# Altium project HHL_Control_board_Rev1.PrjPcb (part 2 of 2)

## Sheet Ethernet.SchDoc
size 420 x 297 mm; Address1: Address1; Address2: Address2; Address3: Address3; Address4: Address4; DocumentNumber: *Э3; SheetNumber: 13; SheetTotal: 14; DocumentType: Схема электрическая *
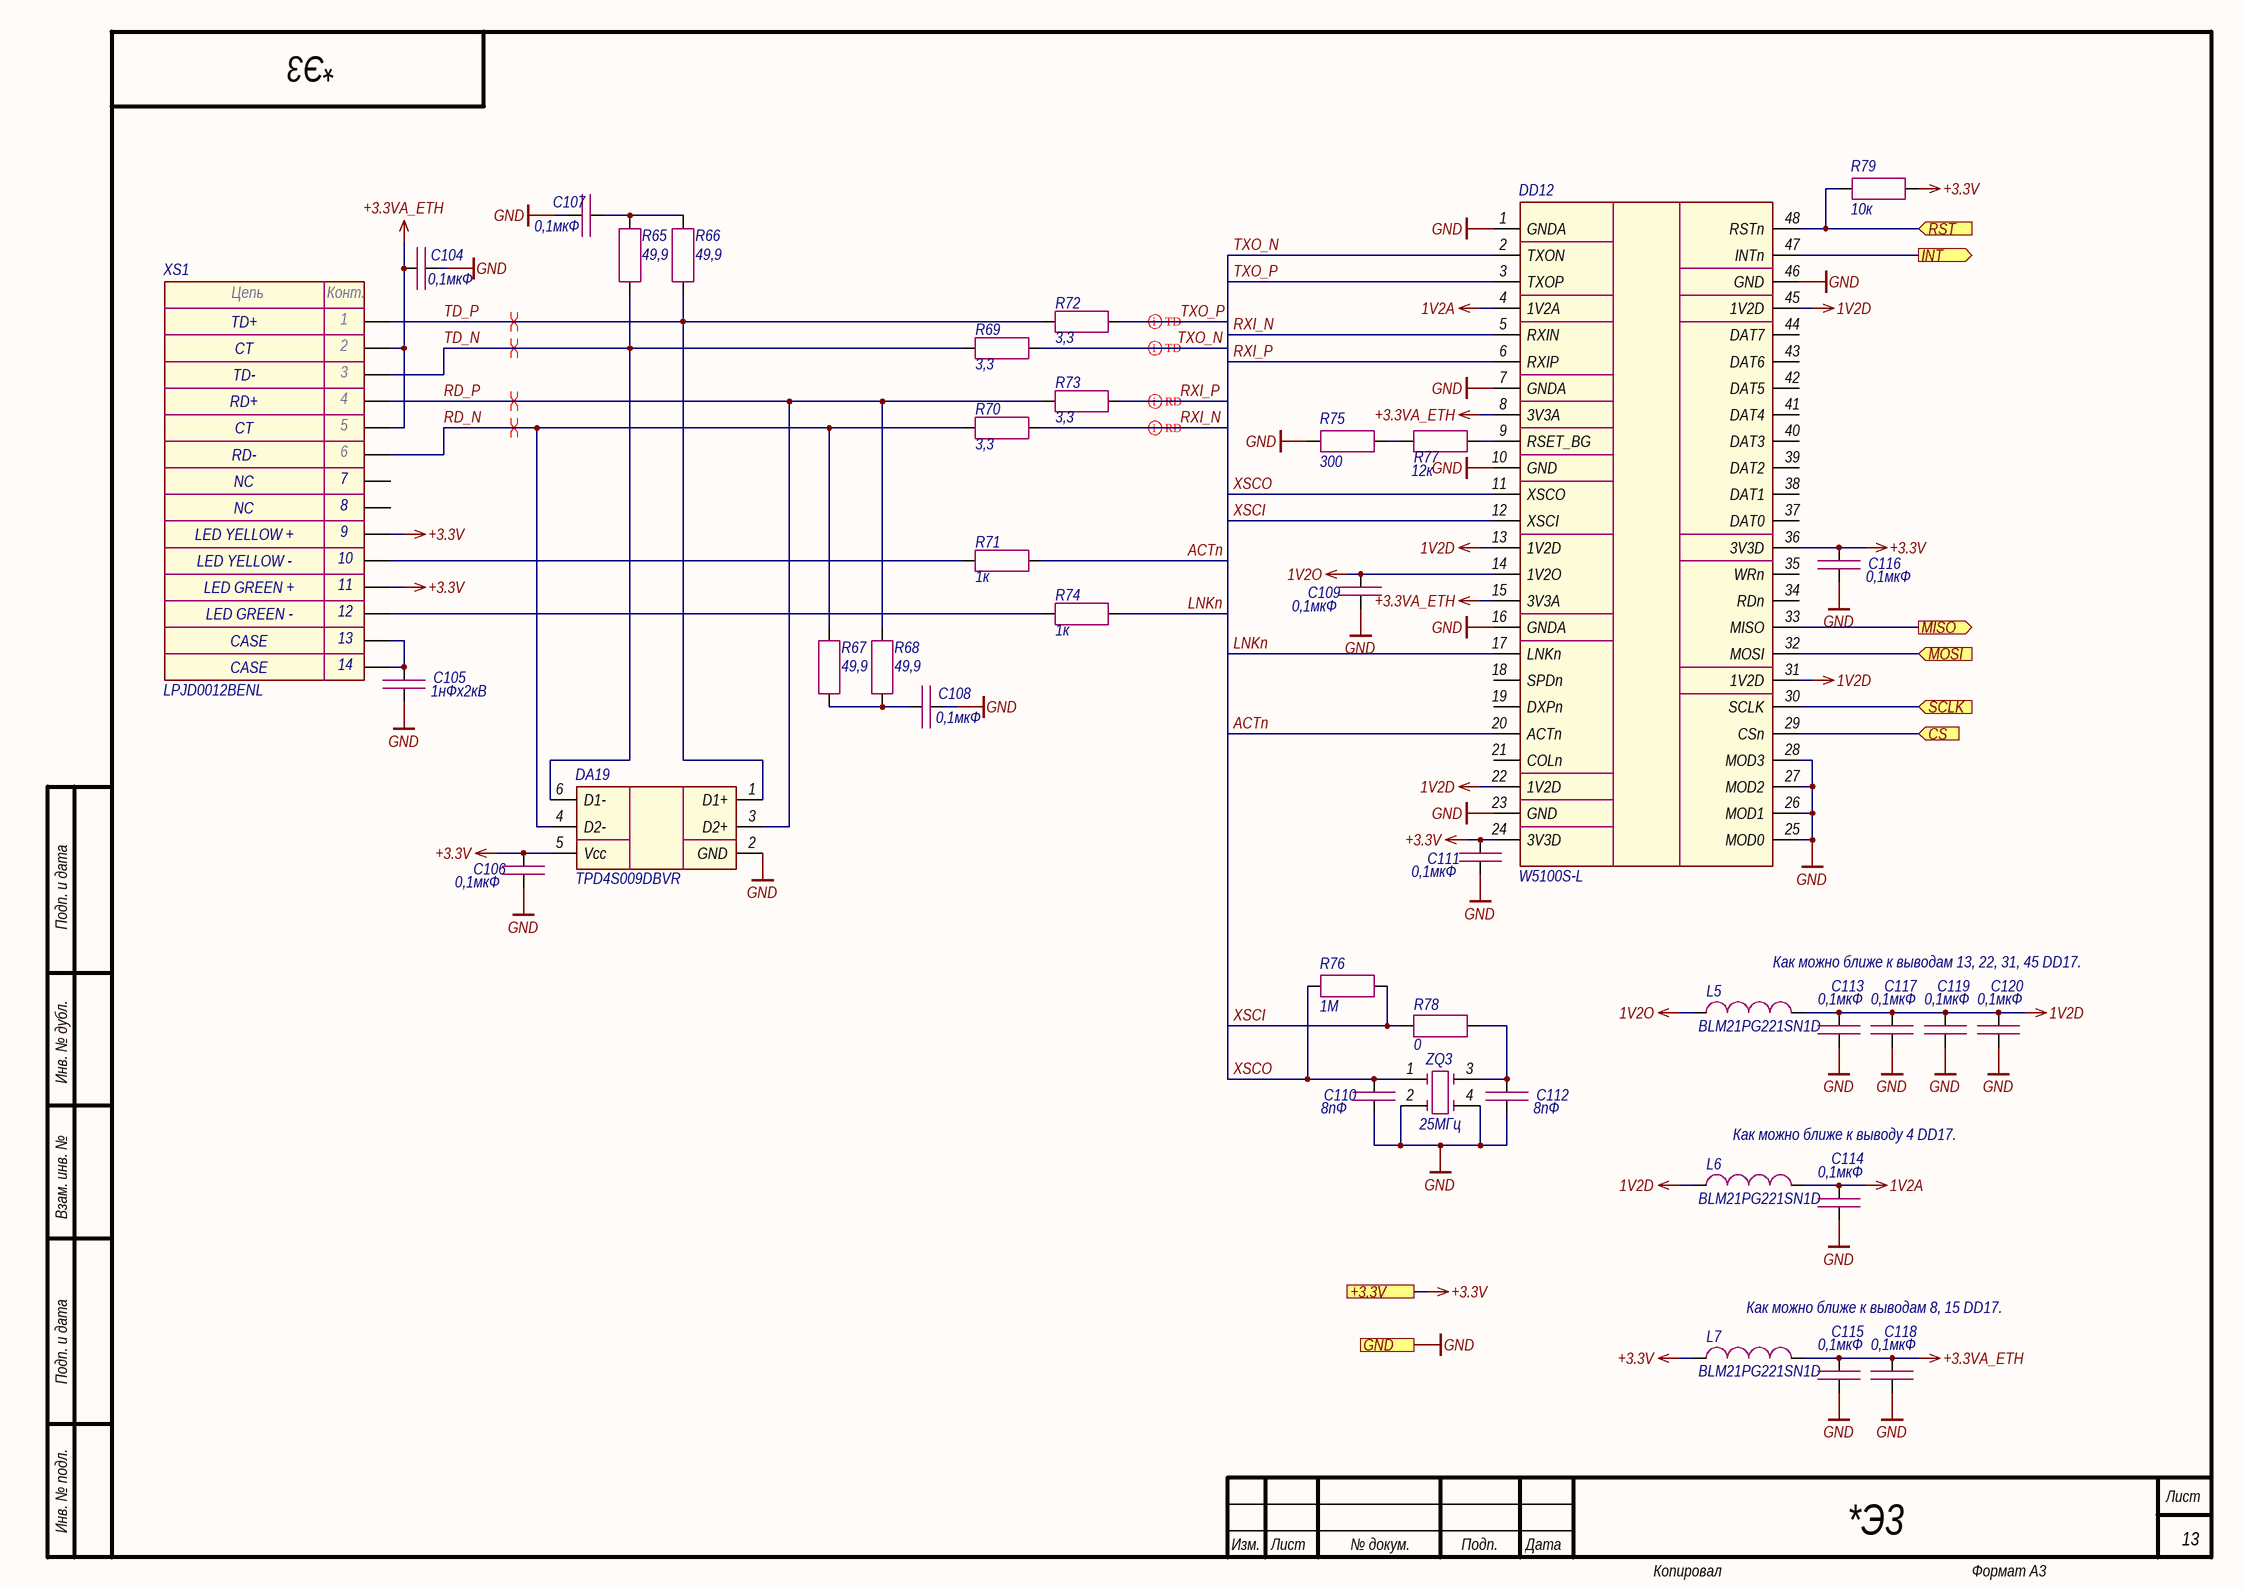
[diagram p12: Ethernet.SchDoc]

### Parts
C104  0,1мкФ  [CAP_0603]
C105  1нФх2кВ  [CAP_1206]
C106  0,1мкФ  [CAP_0603]
C107  0,1мкФ  [CAP_0603]
C108  0,1мкФ  [CAP_0603]
C109  0,1мкФ  [CAP_0603]
C110  8пФ  [CAP_0603]
C111  0,1мкФ  [CAP_0603]
C112  8пФ  [CAP_0603]
C113  0,1мкФ  [CAP_0603]
C114  0,1мкФ  [CAP_0603]
C115  0,1мкФ  [CAP_0603]
C116  0,1мкФ  [CAP_0603]
C117  0,1мкФ  [CAP_0603]
C118  0,1мкФ  [CAP_0603]
C119  0,1мкФ  [CAP_0603]
C120  0,1мкФ  [CAP_0603]
DA19  TPD4S009DBVR  [SOT-23-6]
DD12  W5100S-L  [LQFP-48]
L5  BLM21PG221SN1D  [IND_0805]
L6  BLM21PG221SN1D  [IND_0805]
L7  BLM21PG221SN1D  [IND_0805]
R65  49,9  [RES_0603]
R66  49,9  [RES_0603]
R67  49,9  [RES_0603]
R68  49,9  [RES_0603]
R69  3,3  [RES_0603]
R70  3,3  [RES_0603]
R71  1к  [RES_0603]
R72  3,3  [RES_0603]
R73  3,3  [RES_0603]
R74  1к  [RES_0603]
R75  300  [RES_0603]
R76  1М  [RES_0603]
R77  12к  [RES_0603]
R78  0  [RES_0603]
R79  10к  [RES_0603]
XS1  LPJD0012BENL  [LPJD0012BENL]
ZQ3  25МГц  [7M]

### Ports
+3.3V (see Main[1C], Button[1D], Fiber_interlock[2C], Flow_sensor[2C], LD_driver[1D], Power_supply[2C], RS-485[2C]), CS (in, see Main[1C]), GND (see Main[1C], Button[1D], Column[1C], Fiber_interlock[2C], Flow_sensor[2C], Guide_laser[1C], Indication[1C], LD_driver[1D], Power_supply[2C], RS-485[2C]), INT (out, see Main[1C]), MISO (out, see Main[1C]), MOSI (in, see Main[1C]), RST (in, see Main[1C]), SCLK (in, see Main[1C])

### Nets
1V2A: C114.1 DD12.4(1V2A) L6.2
1V2D: C113.1 C117.1 C119.1 C120.1 DD12.13(1V2D) DD12.22(1V2D) DD12.31(1V2D) DD12.45(1V2D) L5.2 L6.1
1V2O: C109.1 DD12.14(1V2O) L5.1
+3.3V: C106.1 C111.1 C116.1 DA19.5(Vcc) DD12.24(3V3D) DD12.36(3V3D) L7.1 R79.2 XS1.9 XS1.11 ; port +3.3V
+3.3VA_ETH: C104.1 C115.1 C118.1 DD12.8(3V3A) DD12.15(3V3A) L7.2 XS1.2 XS1.5
GND: C104.2 C105.2 C106.2 C107.2 C108.2 C109.2 C110.2 C111.2 C112.2 C113.2 C114.2 C115.2 C116.2 C117.2 C118.2 C119.2 C120.2 DA19.2(GND) DD12.1(GNDA) DD12.7(GNDA) DD12.10(GND) DD12.16(GNDA) DD12.23(GND) DD12.25(MOD0) DD12.26(MOD1) DD12.27(MOD2) DD12.28(MOD3) DD12.46(GND) R75.1 ZQ3.2 ZQ3.4 ; port GND
ACTn: DD12.20(ACTn) R71.2
ETH_CS: DD12.29(CSn) ; port CS
ETH_INT: DD12.47(INTn) ; port INT
ETH_MISO: DD12.33(MISO) ; port MISO
ETH_MOSI: DD12.32(MOSI) ; port MOSI
ETH_RST: DD12.48(RSTn) R79.1 ; port RST
ETH_SCLK: DD12.30(SCLK) ; port SCLK
LNKn: DD12.17(LNKn) R74.2
RD_N: DA19.4(D2-) R67.1 R70.2 XS1.6
RD_P: DA19.3(D2+) R68.1 R73.2 XS1.4
RXI_N: DD12.5(RXIN) R70.1
RXI_P: DD12.6(RXIP) R73.1
TD_N: DA19.6(D1-) R65.1 R69.2 XS1.3
TD_P: DA19.1(D1+) R66.1 R72.2 XS1.1
TXO_N: DD12.2(TXON) R69.1
TXO_P: DD12.3(TXOP) R72.1
XSCI: DD12.12(XSCI) R76.2 R78.1
XSCO: C110.1 DD12.11(XSCO) R76.1 ZQ3.1
NetC105_1: C105.1 XS1.13 XS1.14
NetC107_1: C107.1 R65.2 R66.2
NetC108_1: C108.1 R67.2 R68.2
NetC112_1: C112.1 R78.2 ZQ3.3
NetDD12_9: DD12.9(RSET_BG) R77.2
NetR71_1: R71.1 XS1.10
NetR74_1: R74.1 XS1.12
NetR75_2: R75.2 R77.1

Not connected (* = marked no-connect by the designer): DD12 18(SPDn) 19(DXPn) 21(COLn) 34(RDn) 35(WRn) 37(DAT0) 38(DAT1) 39(DAT2) 40(DAT3) 41(DAT4) 42(DAT5) 43(DAT6) 44(DAT7); XS1 7 8

### Layout directives
differential pair; differential pair class TD: TXO_N, TXO_P
differential pair; differential pair class RD: RXI_N, RXI_P
differential pair: RD_N, RD_P, TD_N, TD_P

### Notes on the sheet
- Как можно ближе к выводам 13, 22, 31, 45 DD17.
- Как можно ближе к выводу 4 DD17.
- Как можно ближе к выводам 8, 15 DD17.
- Подп. и дата
- Инв. № дубл.
- Взам. инв. №
- Инв. № подл.
- Изм.
- Лист
- № докум.
- Подп.
- Дата
- Копировал
- Формат А3
- (in symbol LPJD0012BENL) Цепь; Конт.; TD+; CT; TD-; RD+; RD-; NC; LED YELLOW +; LED YELLOW -; LED GREEN +; LED GREEN -; CASE

### Library data of the parts
C104 C106-C109 C111 C113-C120 = Capacitor: Manufacturer: Murata; Model: GRM188R71H104KA93D; Value: 0,1мкФ; Document: *
C105 = Capacitor: Manufacturer: Yageo; Model: CC1206KKX7RDBB102; Value: 1нФх2кВ; Document: *
C110 C112 = Capacitor: Manufacturer: Yageo; Model: CC0603CRNPO9BN8R0; Value: 8пФ; Document: *
DA19 = TPD4S009: Manufacturer: Texas Instruments; Model: TPD4S009DBVR; Document: *
DD12 = W5100S: Manufacturer: Wiznet; Model: W5100S-L; Document: *
L5-L7 = Inductor: Manufacturer: Murata; Value: *; Model: BLM21PG221SN1D; Document: *
R65-R68 = Resistor: Manufacturer: Yageo; Model: RC0603FR-0749R9L; Value: 49,9; Document: *
R69 R70 R72 R73 = Resistor: Manufacturer: Yageo; Model: RC0603FR-073R3L; Value: 3,3; Document: *
R71 R74 = Resistor: Manufacturer: Yageo; Model: RC0603FR-071KL; Value: 1к; Document: *
R75 = Resistor: Manufacturer: Yageo; Model: RC0603FR-07300RL; Value: 300; Document: *
R76 = Resistor: Manufacturer: Yageo; Model: RC0603FR-071ML; Value: 1М; Document: *
R77 = Resistor: Manufacturer: Yageo; Model: RC0603FR-0712KL; Value: 12к; Document: *
R78 = Resistor: Manufacturer: Yageo; Model: RC0603FR-070RL; Value: 0; Document: *
R79 = Resistor: Manufacturer: Yageo; Model: RC0603FR-0710KL; Value: 10к; Document: *
XS1 = LPJD0012BENL: Manufacturer: LINK-PP; Model: LPJD0012BENL; Document: *
ZQ3 = Quartz_Resonator_4-pin: Manufacturer: TXC; Model: 7M-25.000MAAJ-T; Value: 25МГц; Document: *

## Sheet Analog_isolation.SchDoc
size 420 x 297 mm; Address1: Address1; Address2: Address2; Address3: Address3; Address4: Address4; DocumentNumber: *Э3; SheetNumber: 14; SheetTotal: 14; DocumentType: Схема электрическая *
Used 5 times, as channels A24, A25, A26, A27, A28. Parts and nets are listed once, with the designators drawn on the sheet.
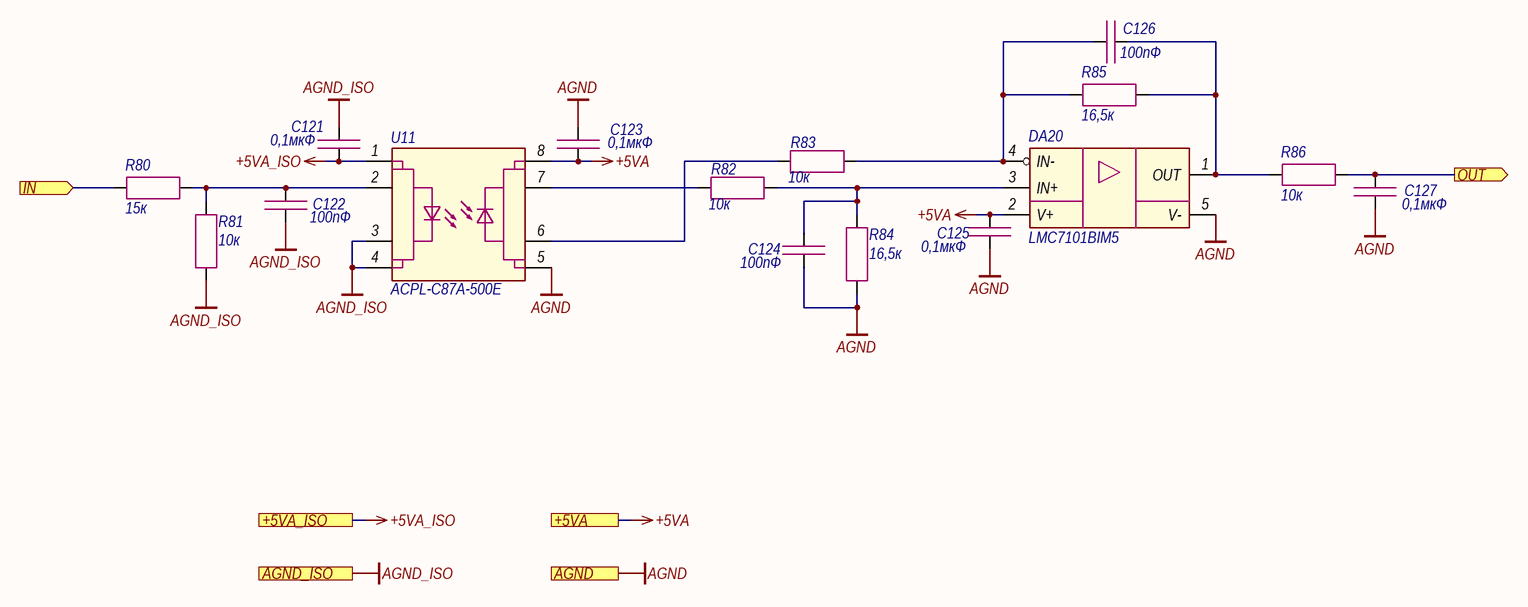
[diagram p13: Analog_isolation.SchDoc]

### Parts
C121  0,1мкФ  [CAP_0603]
C122  100пФ  [CAP_0603]
C123  0,1мкФ  [CAP_0603]
C124  100пФ  [CAP_0603]
C125  0,1мкФ  [CAP_0603]
C126  100пФ  [CAP_0603]
C127  0,1мкФ  [CAP_0603]
DA20  LMC7101BIM5  [SOT-23-5]
R80  15к  [RES_0603]
R81  10к  [RES_0603]
R82  10к  [RES_0603]
R83  10к  [RES_0603]
R84  16,5к  [RES_0603]
R85  16,5к  [RES_0603]
R86  10к  [RES_0603]
U11  ACPL-C87A-500E  [SSO-8]

### Ports
+5VA (see Main[1C], LD_driver[1D], Photodiode[1C]), +5VA_ISO (see Main[1C]), AGND (see Main[1C], LD_driver[1D], Photodiode[1D], Thermistor[2C]), AGND_ISO (see Main[1C]), IN (in, see Main[1C]), OUT (out, see Main[1C])

### Nets
+5VA: C123.1 C125.1 DA20.2(V+) U11.8(VDD2) ; port +5VA
+5VA_ISO: C121.1 U11.1(VDD1) ; port +5VA_ISO
AGND: C123.2 C124.2 C125.2 C127.2 DA20.5(V-) R84.2 U11.5(GND2) ; port AGND
AGND_ISO: C121.2 C122.1 R81.2 U11.3(SHDN) U11.4(GND1) ; port AGND_ISO
IN: R80.2 ; port IN
OUT: C127.1 R86.2 ; port OUT
NetC122_2: C122.2 R80.1 R81.1 U11.2(VIN)
NetC124_1: C124.1 DA20.3(IN+) R82.2 R84.1
NetC126_1: C126.1 DA20.4(IN-) R83.2 R85.2
NetC126_2: C126.2 DA20.1(OUT) R85.1 R86.1
NetR82_1: R82.1 U11.7(VOUT+)
NetR83_1: R83.1 U11.6(VOUT-)

### Channels
A24: designators end in A24; ports +5VA=+5VA +5VA_ISO=+5VA_CS AGND=AGND AGND_ISO=AGND_CS IN=CS1 OUT=EXT1_AN_MOD
A25: designators end in A25; ports +5VA=+5VA +5VA_ISO=+5VA_CS AGND=AGND AGND_ISO=AGND_CS IN=CS2 OUT=EXT2_AN_MOD
A26: designators end in A26; ports +5VA=+5VA +5VA_ISO=+5VA_CS AGND=AGND AGND_ISO=AGND_CS IN=CS3 OUT=EXT3_AN_MOD
A27: designators end in A27; ports +5VA=+5VA +5VA_ISO=+5VA_CS AGND=AGND AGND_ISO=AGND_CS IN=CS4 OUT=EXT4_AN_MOD
A28: designators end in A28; ports +5VA=+5VA +5VA_ISO=+5VA_CS AGND=AGND AGND_ISO=AGND_CS IN=CS5 OUT=EXT5_AN_MOD

### Notes on the sheet
- Подп. и дата
- Инв. № дубл.
- Взам. инв. №
- Инв. № подл.
- Изм.
- Лист
- № докум.
- Подп.
- Дата
- Копировал
- Формат А3

### Library data of the parts
C121 C123 C125 C127 = Capacitor: as C104 on sheet Ethernet; Value: 0,1мкФ; Document: *
C122 C124 C126 = Capacitor: Manufacturer: Murata; Model: GRM1885C1H101JA01D; Value: 100пФ; Document: *
DA20 = LMC7101: Manufacturer: Texas Instruments; Model: LMC7101BIM5; Document: *
R80 = Resistor: Manufacturer: Yageo; Model: RC0603FR-0715KL; Value: 15к; Document: *
R81-R83 R86 = Resistor: as R79 on sheet Ethernet; Value: 10к; Document: *
R84 R85 = Resistor: Manufacturer: Yageo; Model: RC0603FR-0716K5L; Value: 16,5к; Document: *
U11 = ACPL-C87: Manufacturer: Broadcom; Model: ACPL-C87A-500E

## Nets that join several sheets
+3.3V: Main (36 pins), A6 (5 pins), A7 (5 pins), A8 (5 pins), A9 (5 pins), A10 (5 pins), A11 (5 pins), A12 (5 pins), A13 (5 pins), A14 (5 pins), A15 (5 pins), Button (9 pins), Fiber_interlock (C90.1 DD9.5 R62.2), Flow_sensor (C95.1 DD10.8), RS-485 (6 pins), Ethernet (10 pins)
+3.3VA: Main (6 pins), Photodiode (C43.1 C44.1 DA6.4 R18.3), A5 (R19A5.1), A2 (R19A2.1), A3 (R19A3.1), A4 (R19A4.1), A11 (C58A11.1 DA9A11.5), A12 (C58A12.1 DA9A12.5), A13 (C58A13.1 DA9A13.5), A14 (C58A14.1 DA9A14.5), A15 (C58A15.1 DA9A15.5)
+5V: Main (8 pins), Guide_laser (5 pins)
+5VA: Main (C5.1 L1.2), Photodiode (C39.1 C40.1 DA5.7 DA5.8), A11 (6 pins), A12 (6 pins), A13 (6 pins), A14 (6 pins), A15 (6 pins), A24 (C123A24.1 C125A24.1 DA20A24.2 U11A24.8), A25 (C123A25.1 C125A25.1 DA20A25.2 U11A25.8), A26 (C123A26.1 C125A26.1 DA20A26.2 U11A26.8), A27 (C123A27.1 C125A27.1 DA20A27.2 U11A27.8), A28 (C123A28.1 C125A28.1 DA20A28.2 U11A28.8)
+5VA_CS: Main (C6.1 L2.2), A24 (C121A24.1 U11A24.1), A25 (C121A25.1 U11A25.1), A26 (C121A26.1 U11A26.1), A27 (C121A27.1 U11A27.1), A28 (C121A28.1 U11A28.1)
+24V: Main (5 pins), A11 (C57A11.1 DA11A11.2), A12 (C57A12.1 DA11A12.2), A13 (C57A13.1 DA11A13.2), A14 (C57A14.1 DA11A14.2), A15 (C57A15.1 DA11A15.2), Indication (XP9.1 XP9.3 XP9.5), Column (XP10.1 XP10.3 XP10.5), Button (C81.2 DA17.3), Flow_sensor (C91.1 DA18.2)
-5VA: Main (C21.1 L4.2), Photodiode (C37.2 C38.1 DA5.4 R12.1)
AGND: Main (13 pins), Photodiode (15 pins), A5 (C45A5.2), A2 (C45A2.2), A3 (C45A3.2), A4 (C45A4.2), A11 (14 pins), A12 (14 pins), A13 (14 pins), A14 (14 pins), A15 (14 pins), A24 (7 pins), A25 (7 pins), A26 (7 pins), A27 (7 pins), A28 (7 pins)
AGND_CS: Main (7 pins), A24 (5 pins), A25 (5 pins), A26 (5 pins), A27 (5 pins), A28 (5 pins)
GND: Main (50 pins), A6 (5 pins), A7 (5 pins), A8 (5 pins), A9 (5 pins), A10 (5 pins), A11 (6 pins), A12 (6 pins), A13 (6 pins), A14 (6 pins), A15 (6 pins), Guide_laser (8 pins), Indication (U4.2 U5.2 U6.2), Column (U7.3 U8.3 U9.3), Button (13 pins), Fiber_interlock (C89.2 C90.2 DD9.3 XP12.2), Flow_sensor (C95.2 DD10.5 DD10.7), RS-485 (6 pins), Ethernet (31 pins)
GND_24V: Main (5 pins), A11 (C57A11.2 DA11A11.1), A12 (C57A12.2 DA11A12.1), A13 (C57A13.2 DA11A13.1), A14 (C57A14.2 DA11A14.1), A15 (C57A15.2 DA11A15.1), Indication (U4.3 U5.3 U6.3), Column (U7.4 U8.4 U9.4), Button (C81.1 C82.2 DA17.2 U10.3), Flow_sensor (C91.2 DA18.1)
CRASH_COL: Main (DD1.128), Column (R53.2)
CRASH_IND: Main (DD1.125), Indication (R50.2)
CS1: Main (XP3.1), A24 (R80A24.2)
CS2: Main (XP3.3), A25 (R80A25.2)
CS3: Main (XP3.5), A26 (R80A26.2)
CS4: Main (XP3.7), A27 (R80A27.2)
CS5: Main (XP3.9), A28 (R80A28.2)
DRV1_ADC: Main (DD1.43), A11 (C76A11.1 R40A11.2)
DRV1_AN_MOD: Main (DD1.75), A11 (R25A11.1)
DRV1_DIG_MOD: Main (DD1.100), A11 (DD5A11.4)
DRV1_ERR1: Main (DD1.73), A11 (DD5A11.5)
DRV1_ERR2: Main (DD1.74), A11 (DD5A11.6)
DRV1_ON: Main (DD1.66), A11 (DD5A11.3)
DRV1_SEL_AN: Main (DD1.67), A11 (DA9A11.6)
DRV2_ADC: Main (DD1.44), A12 (C76A12.1 R40A12.2)
DRV2_AN_MOD: Main (DD1.96), A12 (R25A12.1)
DRV2_DIG_MOD: Main (DD1.101), A12 (DD5A12.4)
DRV2_ERR1: Main (DD1.78), A12 (DD5A12.5)
DRV2_ERR2: Main (DD1.79), A12 (DD5A12.6)
DRV2_ON: Main (DD1.76), A12 (DD5A12.3)
DRV2_SEL_AN: Main (DD1.77), A12 (DA9A12.6)
DRV3_ADC: Main (DD1.45), A13 (C76A13.1 R40A13.2)
DRV3_AN_MOD: Main (DD1.97), A13 (R25A13.1)
DRV3_DIG_MOD: Main (DD1.102), A13 (DD5A13.4)
DRV3_ERR1: Main (DD1.82), A13 (DD5A13.5)
DRV3_ERR2: Main (DD1.85), A13 (DD5A13.6)
DRV3_ON: Main (DD1.80), A13 (DD5A13.3)
DRV3_SEL_AN: Main (DD1.81), A13 (DA9A13.6)
DRV4_ADC: Main (DD1.46), A14 (C76A14.1 R40A14.2)
DRV4_AN_MOD: Main (DD1.98), A14 (R25A14.1)
DRV4_DIG_MOD: Main (DD1.103), A14 (DD5A14.4)
DRV4_ERR1: Main (DD1.88), A14 (DD5A14.5)
DRV4_ERR2: Main (DD1.89), A14 (DD5A14.6)
DRV4_ON: Main (DD1.86), A14 (DD5A14.3)
DRV4_SEL_AN: Main (DD1.87), A14 (DA9A14.6)
DRV5_ADC: Main (DD1.47), A15 (C76A15.1 R40A15.2)
DRV5_AN_MOD: Main (DD1.99), A15 (R25A15.1)
DRV5_DIG_MOD: Main (DD1.110), A15 (DD5A15.4)
DRV5_ERR1: Main (DD1.92), A15 (DD5A15.5)
DRV5_ERR2: Main (DD1.93), A15 (DD5A15.6)
DRV5_ON: Main (DD1.90), A15 (DD5A15.3)
DRV5_SEL_AN: Main (DD1.91), A15 (DA9A15.6)
EMER_BUT: Main (DD1.117), Button (DD6.4)
EMIS_COL: Main (DD1.127), Column (R52.2)
EMIS_IND: Main (DD1.124), Indication (R49.2)
ETH_CS: Main (DD1.114), Ethernet (DD12.29)
ETH_INT: Main (DD1.116), Ethernet (DD12.47)
ETH_MISO: Main (DD1.112), Ethernet (DD12.33)
ETH_MOSI: Main (DD1.113), Ethernet (DD12.32)
ETH_RST: Main (DD1.115), Ethernet (DD12.48 R79.1)
ETH_SCLK: Main (DD1.111), Ethernet (DD12.30)
EXT1_AN_MOD: Main (DD1.36), A11 (DA9A11.1), A24 (C127A24.1 R86A24.2)
EXT2_AN_MOD: Main (DD1.37), A12 (DA9A12.1), A25 (C127A25.1 R86A25.2)
EXT3_AN_MOD: Main (DD1.40), A13 (DA9A13.1), A26 (C127A26.1 R86A26.2)
EXT4_AN_MOD: Main (DD1.41), A14 (DA9A14.1), A27 (C127A27.1 R86A27.2)
EXT5_AN_MOD: Main (DD1.42), A15 (DA9A15.1), A28 (C127A28.1 R86A28.2)
FIBER_IL: Main (DD1.129), Fiber_interlock (DD9.4)
FLOW: Main (DD1.4), Flow_sensor (DD10.6)
GUIDE_LAS: Main (DD1.21), Guide_laser (R41.1)
KEY: Main (DD1.118), Button (DD7.4)
PD1_A: Main (XP1.2), Photodiode (R12.2 R13.1)
PD1_ADC: Main (DD1.27), Photodiode (C41.1 R16.2)
PD1_C: Main (XP1.1), Photodiode (C36.2 DA5.2 R11.1)
PD1_ERR: Main (DD1.26), Photodiode (DA6.5)
POWER_COL: Main (DD1.126), Column (R51.2)
POWER_IND: Main (DD1.123), Indication (R48.2)
PS1_ERR1: Main (DD1.142), A6 (DD4A6.7)
PS1_ERR2: Main (DD1.1), A6 (DD4A6.6)
PS1_ON: Main (DD1.141), A6 (R21A6.1)
PS1_PV: Main (DD1.136), A6 (DD3A6.2)
PS2_ERR1: Main (DD1.3), A7 (DD4A7.7)
PS2_ERR2: Main (DD1.5), A7 (DD4A7.6)
PS2_ON: Main (DD1.2), A7 (R21A7.1)
PS2_PV: Main (DD1.137), A7 (DD3A7.2)
PS3_ERR1: Main (DD1.10), A8 (DD4A8.7)
PS3_ERR2: Main (DD1.11), A8 (DD4A8.6)
PS3_ON: Main (DD1.7), A8 (R21A8.1)
PS3_PV: Main (DD1.139), A8 (DD3A8.2)
PS4_ERR1: Main (DD1.13), A9 (DD4A9.7)
PS4_ERR2: Main (DD1.14), A9 (DD4A9.6)
PS4_ON: Main (DD1.12), A9 (R21A9.1)
PS4_PV: Main (DD1.140), A9 (DD3A9.2)
PS5_ERR1: Main (DD1.18), A10 (DD4A10.7)
PS5_ERR2: Main (DD1.19), A10 (DD4A10.6)
PS5_ON: Main (DD1.15), A10 (R21A10.1)
PS5_PV: Main (DD1.20), A10 (DD3A10.2)
RE/DE: Main (DD1.68), RS-485 (DD11.4 DD11.5)
Rx485: Main (DD1.70), RS-485 (DD11.3)
START_BUT: Main (DD1.119), Button (DD8.4)
START_IND: Main (DD1.122), Button (R60.2)
T1: Main (XP2.1), A2 (R19A2.2 R20A2.1)
T1_ADC: Main (DD1.28), A2 (C45A2.1 R20A2.2)
T2: Main (XP2.3), A3 (R19A3.2 R20A3.1)
T2_ADC: Main (DD1.29), A3 (C45A3.1 R20A3.2)
T3: Main (XP2.5), A4 (R19A4.2 R20A4.1)
T3_ADC: Main (DD1.34), A4 (C45A4.1 R20A4.2)
T4: Main (XP2.7), A5 (R19A5.2 R20A5.1)
T4_ADC: Main (DD1.35), A5 (C45A5.1 R20A5.2)
Tx485: Main (DD1.69), RS-485 (DD11.6)